# Altium schematic sheet esp32_wroom.SchDoc
size A; SheetNumber: 2; SheetTotal: 3
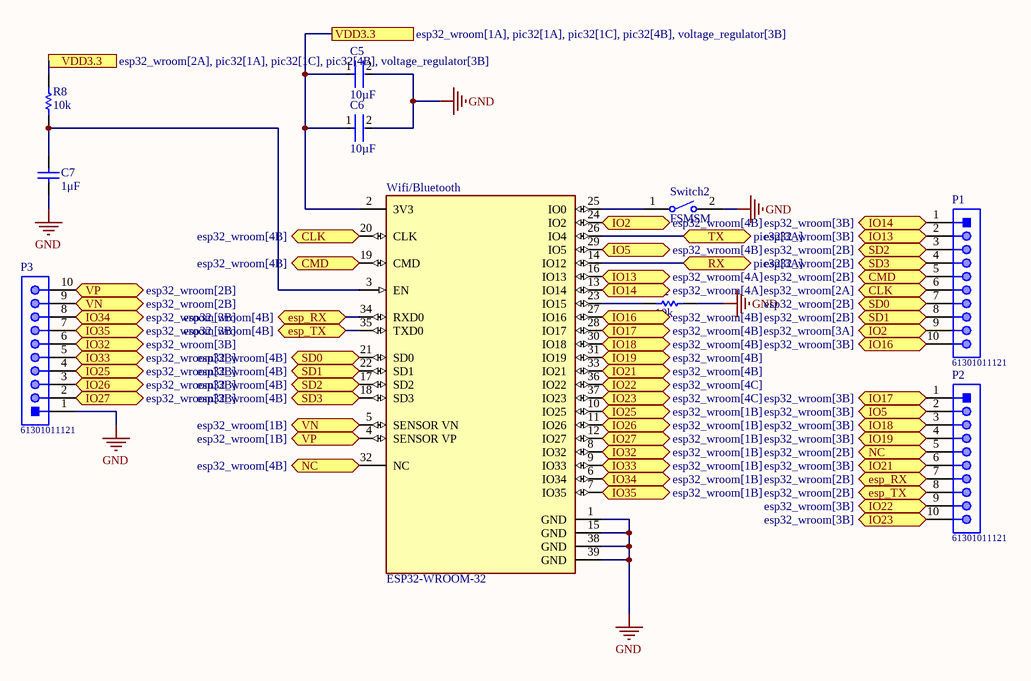
[diagram p0: esp32_wroom.SchDoc]

## Parts
C5  10µF  [FP-GRM188-0_1-e0_2_0_55-MFG]
C6  10µF  [FP-GRM188-0_1-e0_2_0_55-MFG]
C7  1μF  [CAPC3216X110X50LL20T25]
P1  61301011121  [61301011121]
P2  61301011121  [61301011121]
P3  61301011121  [61301011121]
R2  10k  [RESC1608X55X25ML10T15]
R8  10k  [RESC1608X55X25ML10T15]
Switch2  FSMSM  [TECO-FSMSM-2_V]
Wifi/Bluetooth  ESP32-WROOM-32  [FP-ESP32-WROOM-32-MFG]

## Ports
CLK (bidir, see esp32_wroom[2A]), CLK (bidir, see esp32_wroom[4B]), CMD (bidir, see esp32_wroom[2B]), CMD (bidir, see esp32_wroom[4B]), esp_RX (bidir, see esp32_wroom[2B]), esp_RX (bidir, see esp32_wroom[4B]), esp_TX (bidir, see esp32_wroom[2B]), esp_TX (bidir, see esp32_wroom[4B]), IO2 (bidir, see esp32_wroom[3A]), IO2 (bidir, see esp32_wroom[4B]), IO5 (bidir, see esp32_wroom[3B]), IO5 (bidir, see esp32_wroom[4B]), IO13 (bidir, see esp32_wroom[3B]), IO13 (bidir, see esp32_wroom[4A]), IO14 (bidir, see esp32_wroom[3B]), IO14 (bidir, see esp32_wroom[4A]), IO16 (bidir, see esp32_wroom[3B]), IO16 (bidir, see esp32_wroom[4B]), IO17 (bidir, see esp32_wroom[3B]), IO17 (bidir, see esp32_wroom[4B]), IO18 (bidir, see esp32_wroom[3B]), IO18 (bidir, see esp32_wroom[4B]), IO19 (bidir, see esp32_wroom[3B]), IO19 (bidir, see esp32_wroom[4B]), IO21 (bidir, see esp32_wroom[3B]), IO21 (bidir, see esp32_wroom[4B]), IO22 (bidir, see esp32_wroom[3B]), IO22 (bidir, see esp32_wroom[4C]), IO23 (bidir, see esp32_wroom[3B]), IO23 (bidir, see esp32_wroom[4C]), IO25 (bidir, see esp32_wroom[1B]), IO25 (bidir, see esp32_wroom[3B]), IO26 (bidir, see esp32_wroom[1B]), IO26 (bidir, see esp32_wroom[3B]), IO27 (bidir, see esp32_wroom[1B]), IO27 (bidir, see esp32_wroom[3B]), IO32 (bidir, see esp32_wroom[1B]), IO32 (bidir, see esp32_wroom[3B]), IO33 (bidir, see esp32_wroom[1B]), IO33 (bidir, see esp32_wroom[3B]), IO34 (bidir, see esp32_wroom[1B]), IO34 (bidir, see esp32_wroom[3B]), IO35 (bidir, see esp32_wroom[1B]), IO35 (bidir, see esp32_wroom[3B]), NC (bidir, see esp32_wroom[2B]), NC (bidir, see esp32_wroom[4B]), RX (bidir, see pic32[3A]), SD0 (bidir, see esp32_wroom[2B]), SD0 (bidir, see esp32_wroom[4B]), SD1 (bidir, see esp32_wroom[2B]), SD1 (bidir, see esp32_wroom[4B]), SD2 (bidir, see esp32_wroom[2B]), SD2 (bidir, see esp32_wroom[4B]), SD3 (bidir, see esp32_wroom[2B]), SD3 (bidir, see esp32_wroom[4B]), TX (bidir, see pic32[3A]), VDD3.3 (see esp32_wroom[1A], pic32[1A], pic32[1C], pic32[4B], voltage_regulator[3B]), VDD3.3 (see esp32_wroom[2A], pic32[1A], pic32[1C], pic32[4B], voltage_regulator[3B]), VN (bidir, see esp32_wroom[1B]), VN (bidir, see esp32_wroom[2B]), VP (bidir, see esp32_wroom[1B]), VP (bidir, see esp32_wroom[2B])

## Nets
GND: C5.2 C6.2 C7.1 P3.1 R2.1 Switch2.2 Wifi/Bluetooth.1(GND) Wifi/Bluetooth.15(GND) Wifi/Bluetooth.38(GND) Wifi/Bluetooth.39(GND)
CLK: P1.6 Wifi/Bluetooth.20(CLK) ; port CLK
CMD: P1.5 Wifi/Bluetooth.19(CMD) ; port CMD
esp_RX: P2.7 Wifi/Bluetooth.34(RXD0) ; port esp_RX
esp_TX: P2.8 Wifi/Bluetooth.35(TXD0) ; port esp_TX
IO2: P1.9 Wifi/Bluetooth.24(IO2) ; port IO2
IO5: P2.2 Wifi/Bluetooth.29(IO5) ; port IO5
IO13: P1.2 Wifi/Bluetooth.16(IO13) ; port IO13
IO14: P1.1 Wifi/Bluetooth.13(IO14) ; port IO14
IO16: P1.10 Wifi/Bluetooth.27(IO16) ; port IO16
IO17: P2.1 Wifi/Bluetooth.28(IO17) ; port IO17
IO18: P2.3 Wifi/Bluetooth.30(IO18) ; port IO18
IO19: P2.4 Wifi/Bluetooth.31(IO19) ; port IO19
IO21: P2.6 Wifi/Bluetooth.33(IO21) ; port IO21
IO22: P2.9 Wifi/Bluetooth.36(IO22) ; port IO22
IO23: P2.10 Wifi/Bluetooth.37(IO23) ; port IO23
IO25: P3.4 Wifi/Bluetooth.10(IO25) ; port IO25
IO26: P3.3 Wifi/Bluetooth.11(IO26) ; port IO26
IO27: P3.2 Wifi/Bluetooth.12(IO27) ; port IO27
IO32: P3.6 Wifi/Bluetooth.8(IO32) ; port IO32
IO33: P3.5 Wifi/Bluetooth.9(IO33) ; port IO33
IO34: P3.8 Wifi/Bluetooth.6(IO34) ; port IO34
IO35: P3.7 Wifi/Bluetooth.7(IO35) ; port IO35
NC: P2.5 Wifi/Bluetooth.32(NC) ; port NC
RX: Wifi/Bluetooth.14(IO12) ; port RX
SD0: P1.7 Wifi/Bluetooth.21(SD0) ; port SD0
SD1: P1.8 Wifi/Bluetooth.22(SD1) ; port SD1
SD2: P1.3 Wifi/Bluetooth.17(SD2) ; port SD2
SD3: P1.4 Wifi/Bluetooth.18(SD3) ; port SD3
TX: Wifi/Bluetooth.26(IO4) ; port TX
VDD3.3: C5.1 C6.1 R8.2 Wifi/Bluetooth.2(3V3) ; port VDD3.3
VN: P3.9 Wifi/Bluetooth.5(SENSOR_VN) ; port VN
VP: P3.10 Wifi/Bluetooth.4(SENSOR_VP) ; port VP
NetC7_2: C7.2 R8.1 Wifi/Bluetooth.3(EN)
NetR2_2: R2.2 Wifi/Bluetooth.23(IO15)
NetSwitch2_1: Switch2.1 Wifi/Bluetooth.25(IO0)

## Library data of the parts
C5 C6 = CMP-2006-02793-3: Chip Multilayer Ceramic Capacitors for General Purpose, 0603, 10uF, X5R, 15%, 20%, 6.3V / GRM188R60J106ME47J; Packaging: Tape and Reel; Max Operating Temperature: 85°C; Voltage Rating: 6.3V; Voltage Rating (DC): 6.3V; Voltage: 6.3V; Package Quantity: 10000; Width: 0.8mm; Min Operating Temperature: -55°C; Capacitance: 10uF; Tolerance: 20%; REACH SVHC: No SVHC; Termination: SMD/SMT; Radiation Hardening: No; Lead Free: Lead Free; Dielectric: X5R; Depth: 0.8mm; Mount: Surface Mount; Case Code (Imperial): 0603; Height: 0.8mm; Thickness: 0.035inch; Length: 1.6mm; Case Code (Metric): 1608; Case/Package: 0603
C7 = CMP-2000-06011-1: Chip Capacitor, 1 uF, +/- 10%, 50 V, -55 to 125 degC, 1206 (3216 Metric), RoHS, Tape and Reel / C1206C105K5RACTU; Manufacturer: Kemet; Case Height: 1mm; Dielectric: X7R; Voltage Rating: 50V; Capacitance: 1uF; Temperature Coefficient / Code: +/-15%; Case Length: 3.2mm; Case Width: 1.6mm; Type: SMDMLCCX7R6.3-250VDCCommericalGrade; Class: Class1; Capacitance - nF: 1000nF; Datasheet URL: http://www.kemet.com/docfinder?Partnumber=C1206C105K5RACTU; Product Category: MultilayerCeramicCapacitorsMLCC-SMD/SMT; Termination Style: SMD/SMT; Dimensions: 1.6mmWx3.2mmLx1mmH; Voltage Rating DC: 50V; Datasheet Version: 02/2016; Packaging: Reel; Brand: Kemet; RoHS: Details; Minimum Operating Temperature: -55C; Operating Temperature Range: -55Cto+125C; Package Reference: 1206; Manufacturer URL: http://www.kemet.com/; Product: GeneralTypeMLCCs; Tolerance: 10%; Package Description: 2-Pin Surface Mount Device, Body 3.2 x 1.6 mm; Mounting Technology: SurfaceMount; Case Code - mm: 3216; Maximum Operating Temperature: +125C; Series: C1206C; Factory Pack Quantity: 2500; Package / Case: 1206(3216metric); Case Code - in: 1206
P1-P3 = CMP-1502-01082-1: THT Vertical Pin Header WR-PHD, Pitch 2.54 mm, Single Row, 10 pins; Manufacturer: Wurth Elektronik; Contact Resistance: 20mOhm; Rated Current: 3A; Pitch: 2.54mm; Gender: Male; Pin Number: 10; Working Voltage: 250VAC; Withstanding Voltage: 500VAC; Manufacturer URL: http://www.we-online.de; Operating Temperature: -40to105degC; Datasheet URL: https://katalog.we-online.de/em/datasheet/6130xx11121.pdf; Row Number: Single; Orientation: Vertical; Part Number: 61301011121; Packaging: Bag; Package Reference: 61301011121; Mounting Technology: THT; Publisher: WurthElektronik
R2 R8 = CMP-2100-03664-1: Chip Resistor, 10 KOhm, +/- 1%, 01 W, -55 to 155 degC, 0603 (1608 Metric), RoHS, Tape and Reel / RC0603FR-0710KL; Manufacturer: Yageo; Temperature Coefficient: 100ppm/degreesC; Resistance: 10KOhm; Voltage Rating: 75V; Power Rating: 100mW; Voltage Rating (DC): 50V; Composition: ThickFilm; RoHSCompliant: true; Height: 0.45mm; Lead Free: LeadFree; Case Code (Metric): 1608; Case/Package: 0603; Datasheet Version: Rev. 5, 10/2016; Package Reference: 0603; Depth: 0.8mm; Package Description: 2-Pin Surface Mount Device, Body 1.6 x 0.8 mm; Case Code (Imperial): 0603; Packaging: TapeandReel; Termination: SMD/SMT; Lead Pitch: 0.3mm; Width: 0.8mm; Number of Pins: 2; Length: 1.6mm; REACH SVHC: NoSVHC; Military Standard: Not; Max Operating Temperature: 155degC; Min Operating Temperature: -55degC; Manufacturer URL: http://www.yageo.com/; Datasheet URL: http://www.yageo.com/NewPortal/yageodocoutput?fileName=/pdf/R-Chip/PYu-RC_Group_51_RoHS_L_5.pdf; Weight: 7.1E-05oz; Tolerance: 1%
Switch2 = CMP-2000-07511-1: FSMSM Push Button Switch, 50 mA, -35 to 85 degC, 2-Pin SMD, RoHS, Bulk; Manufacturer: TE Connectivity; Actuator Length: 1.07mm; Electrical Life: 20000Cycles; Actuator Material: Polyamide; Current Rating: 50mA; Illumination Type: Illuminated; Voltage Rating (DC): 24V; Contact Resistance: 100mOhm; Case\/Package: SMD/SMT; Operating Force: 180gf; Switch Travel: 0.25mm; Max Voltage Rating (DC): 12V; Throw Configuration: SPST; Packaging: LoosePiece; Max Operating Temperature: 85degC; ELV: Compliant; Package Description: 2-Pin Surface Mount Device, Body 6 x 3.5 mm, Pitch 9.19 mm; RoHSCompliant: true; Manufacturer URL: http://www.te.com/; Contact Plating: Silver; Contact Material: Brass; Mounting Technology: SurfaceMount; Contact Current Rating: 50mA; Datasheet Version: Rev. C2, 08/2014; Datasheet URL: http://www.te.com/commerce/DocumentDelivery/DDEController?Action=showdoc&DocId=Customer+Drawing%7F1437566-3%7FC2%7Fpdf%7FEnglish%7FENG_CD_1437566-3_C2_1437566_3_1_c.dwg.pdf%7F1437566-3; Mechanical Life: 20000Cycles; Package Reference: FSMSM; REACH SVHC: Unknown; Orientation: Straight; Min Operating Temperature: -35degC; Lead Free: LeadFree; Termination: GullWing; Package Quantity: 1000; Mount: SurfaceMount
Wifi/Bluetooth = CMP-194065-000008-1: RX TXRX MOD WIFI SURFACE MOUNT; Frequency: 2.5GHz; Sensitivity: -98dBm; Operating Supply Voltage: 3.6V; Data Rate: 150Mbps; Weight: 0.088185oz; Package Quantity: 550; Min Operating Temperature: -40°C; Mount: Surface Mount; Max Operating Temperature: 85°C; Packaging: Cut Tape; Case/Package: SMD/SMT